# EAGLE design 3channel_thermocouple (EAGLE 7.7.0)
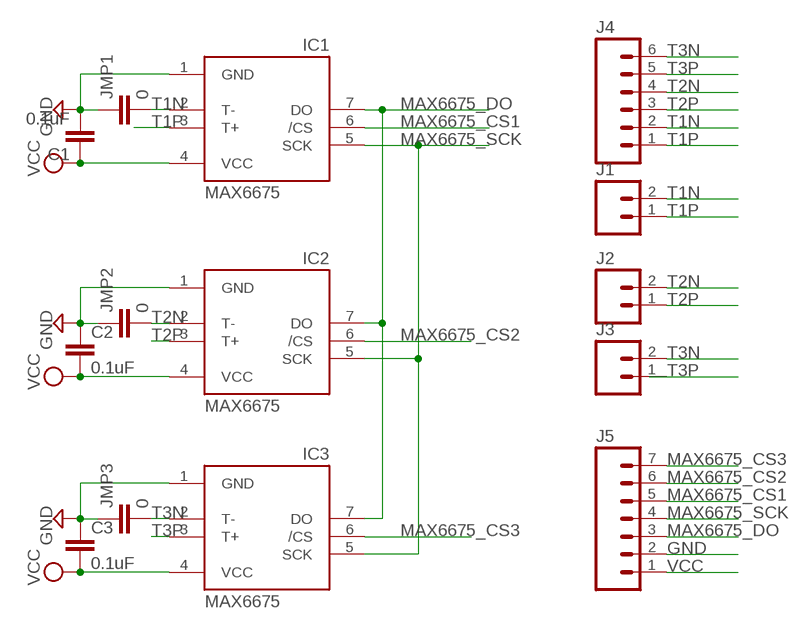
[diagram p0: schematic, sheet 1]

## Parts
C1  0.1uF  0.1UF-25V(+80/-20%)(0603)  [0603-CAP]
C2  0.1uF  0.1UF-25V(+80/-20%)(0603)  [0603-CAP]
C3  0.1uF  0.1UF-25V(+80/-20%)(0603)  [0603-CAP]
IC1  MAX6675  [SO08]
IC2  MAX6675  [SO08]
IC3  MAX6675  [SO08]
J1  M025MM  [SCREWTERMINAL-5MM-2]
J2  M025MM  [SCREWTERMINAL-5MM-2]
J3  M025MM  [SCREWTERMINAL-5MM-2]
J4  M06  [1X6-XH-JST-S6B-RIGHTANGLE]
J5  M07  [1X07]
JMP1  0  0.1UF-25V(+80/-20%)(0603)  [0603-CAP]
JMP2  0  0.1UF-25V(+80/-20%)(0603)  [0603-CAP]
JMP3  0  0.1UF-25V(+80/-20%)(0603)  [0603-CAP]

## Nets
GND: C1.2 C2.1 C3.1 IC1.1(GND) IC2.1(GND) IC3.1(GND) J5.2 JMP1.1 JMP2.1 JMP3.1
MAX6675_CS1: IC1.6(/CS) J5.5
MAX6675_CS2: IC2.6(/CS) J5.6
MAX6675_CS3: IC3.6(/CS) J5.7
MAX6675_DO: IC1.7(DO) IC2.7(DO) IC3.7(DO) J5.3
MAX6675_SCK: IC1.5(SCK) IC2.5(SCK) IC3.5(SCK) J5.4
T1N: IC1.2(T-) J1.2 J4.2 JMP1.2
T1P: IC1.3(T+) J1.1 J4.1
T2N: IC2.2(T-) J2.2 J4.4 JMP2.2
T2P: IC2.3(T+) J2.1 J4.3
T3N: IC3.2(T-) J3.2 J4.6 JMP3.2
T3P: IC3.3(T+) J3.1 J4.5
VCC: C1.1 C2.2 C3.2 IC1.4(VCC) IC2.4(VCC) IC3.4(VCC) J5.1

## Library data of the parts
C1-C3 = 3channel_thermocouple:0.1UF-25V(+80/-20%)(0603): CAP-00810 Ceramic Standard decoupling cap; PROD_ID: CAP-00810
IC1-IC3 = 3channel_thermocouple:MAX6675
J1-J3 = 3channel_thermocouple:M02: Standard 2-pin 0.1" header. Use with - straight break away headers ( PRT-00116) - right angle break away headers (PRT-00553) - swiss pins (PRT-00743) - machine pins (PRT-00117) - female headers (PRT-00115) Molex polarized connector foot print use with: PRT-08233 with associated crimp pins and housings. 2.54_SCREWTERM for use with PRT-10571. 3.5mm Screw Terminal footprints for PRT-08084 5mm Screw Terminal footprints for use with PRT-08432; STOREFRONT_ID: PRT-08432
J4 = 3channel_thermocouple:M06: Header 6 Standard 6-pin 0.1" header. Use with straight break away headers (SKU : PRT-00116), right angle break away headers (PRT-00553), swiss pins (PRT-00743), machine pins (PRT-00117), and female headers (PRT-00115). Molex polarized connector foot print use with SKU : PRT-08094 with associated crimp pins and housings. NOTES ON THE VARIANTS LOCK and LOCK_LONGPADS... This footprint was designed to help hold the alignment of a through-hole component (i.e. 6-pin header) while soldering it into place. You may notice that each hole has been shifted either up or down by 0.005 of an inch from it's more standard position (which is a perfectly straight line). This slight alteration caused the pins (the squares in the middle) to touch the edges of the holes. Because they are alternating, it causes a "brace" to hold the component in place. 0.005 has proven to be the perfect amount of "off-center" position when using our standard breakaway headers. Although looks a little odd when you look at the bare footprint, once you have a header in there, the alteration is very hard to notice. Also,if you push a header all the way into place, it is covered up entirely on the bottom side. This idea of altering the position of holes to aid alignment will be further integrated into the Sparkfun Library for other footprints. It can help hold any component with 3 or more connection pins.
J5 = 3channel_thermocouple:M07: Header 7 Standard 7-pin 0.1" header. Use with straight break away headers (SKU : PRT-00116), right angle break away headers (PRT-00553), swiss pins (PRT-00743), machine pins (PRT-00117), and female headers (PRT-00115). NOTES ON THE VARIANTS LOCK and LOCK_LONGPADS... This footprint was designed to help hold the alignment of a through-hole component (i.e. 7-pin header) while soldering it into place. You may notice that each hole has been shifted either up or down by 0.005 of an inch from it's more standard position (which is usually a perfectly straight line). This slight alteration caused the pins (the squares in the middle) to touch the edges of the holes. Because they are alternating, it causes a "brace" to hold the header in place. 0.005 has proven to be the perfect amount of "off-center" position when using our standard breakaway headers. Although looks a little odd when you look at the bare footprint, once you have a header in there, the alteration is very hard to notice. Also, if you push a header all the way into place, it is covered up entirely on the bottom side. This idea of altering the position of holes to aid alignment will be further integrated into the Sparkfun Library for other footprints. It can help hold any component with 3 or more connection pins.
JMP1-JMP3 = 3channel_thermocouple:0.1UF-25V(+80/-20%)(0603): CAP-00810 Ceramic Standard decoupling cap; PROD_ID: CAP-00810; VALUE: 0.1uF

## Board
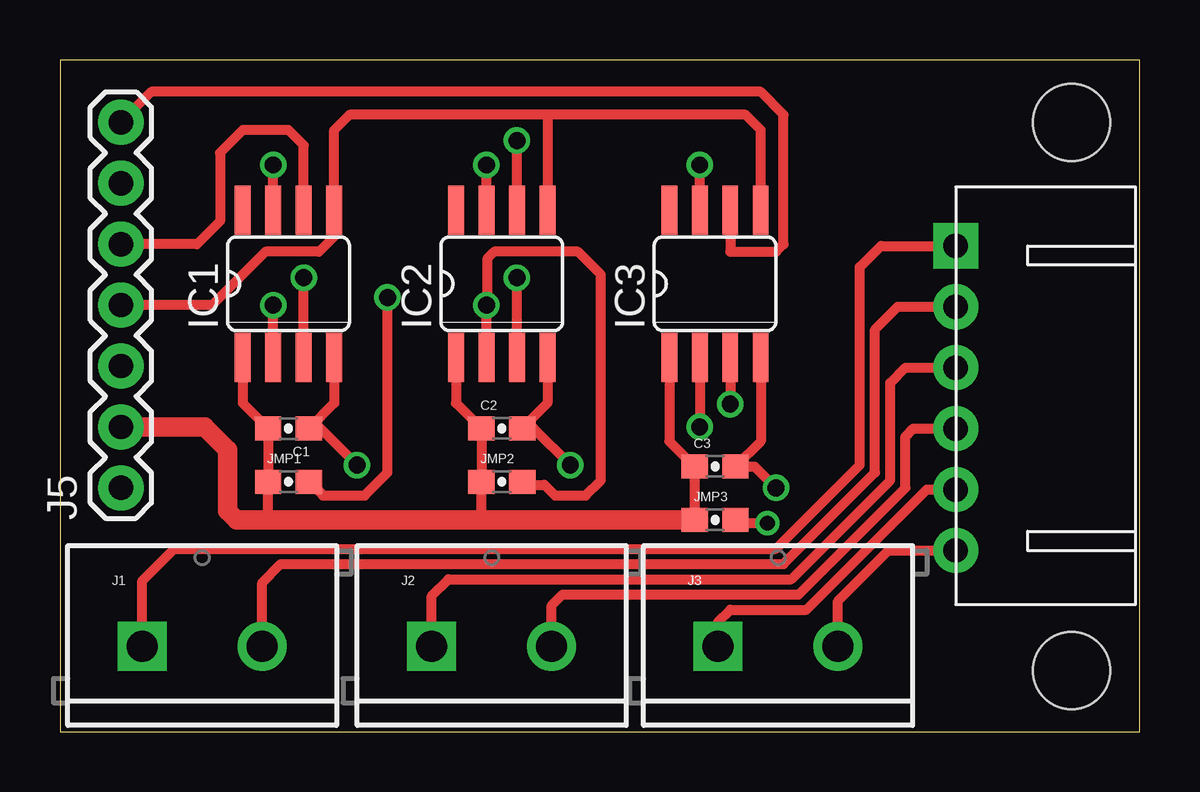
[diagram p1: board, top side]
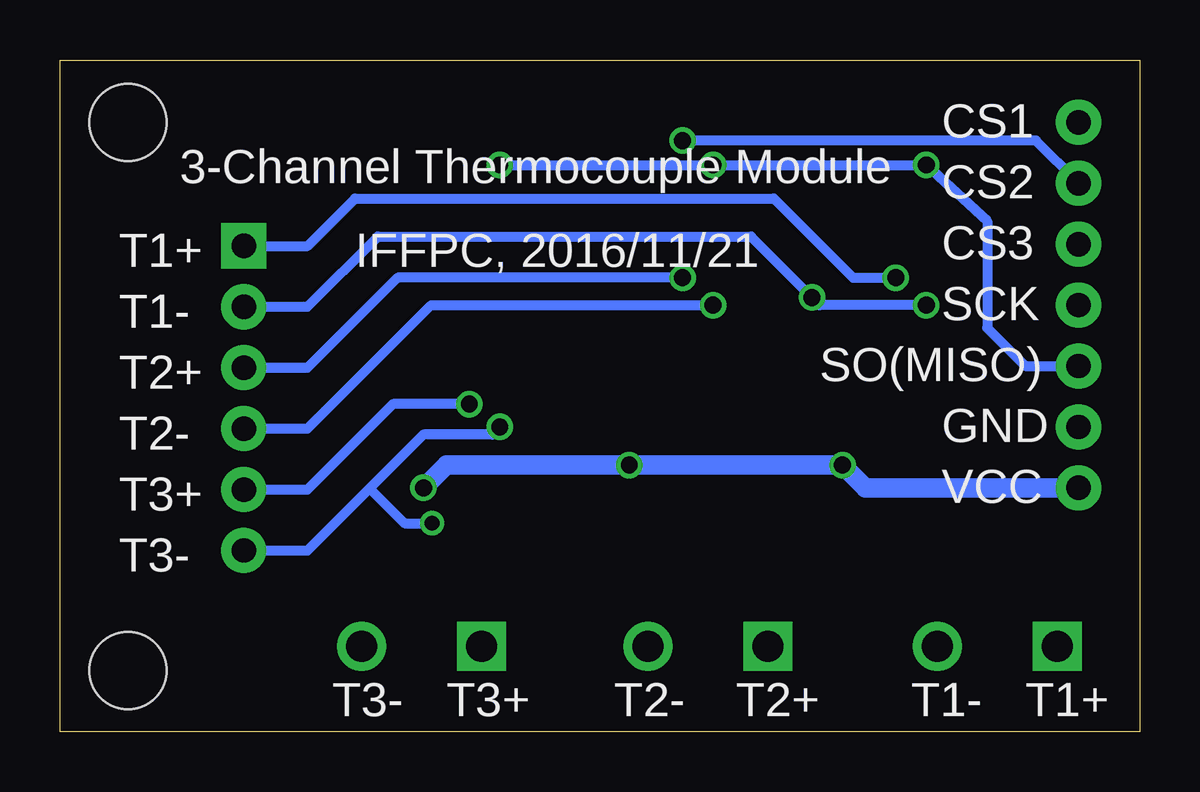
[diagram p2: board, bottom side, seen from below]

Size 45 x 28 mm. Coordinates in mm from the lower left corner, seen from the top.
Outline: 0,0 45,0 45,28 0,28 0,0
Copper layers (1*16): Top 0.035mm / dielectric 1.5mm / Bottom 0.035mm
Design rules "default": minimum track width 10mil, minimum drill 24mil, track to track 8mil, track to pad 8mil, pad to pad 8mil, via to via 8mil, smd to smd 8mil, copper to edge 40mil, drill to drill 8mil, minimum pad ring 10mil, minimum via ring 8mil, stop-mask expansion 4mil, vias tented up to drill 0mil, thermal gap 10mil
Holes 3.2 mm at 42.16,2.54 42.16,25.4

### Footprints (pad centres in the part's own frame; a part is rotated, then mirrored left to right if it is on the bottom)
0603-CAP = smd 1.1 x 1: 1 -0.85,0; 2 0.85,0
SO08 = smd 0.66 x 2.032: 1 -1.905,-3.073; 2 -0.635,-3.073; 3 0.635,-3.073; 4 1.905,-3.073; 5 1.905,3.073; 6 0.635,3.073; 7 -0.635,3.073; 8 -1.905,3.073
SCREWTERMINAL-5MM-2 = drill 1.3 pad 2.032 square: 1 0,0 | drill 1.3 pad 2.032: 2 5,0
1X6-XH-JST-S6B-RIGHTANGLE = drill 1.016 pad 1.88 square: 1 0,0 | drill 1.016 pad 1.88: 2 2.54,0; 3 5.08,0; 4 7.62,0; 5 10.16,0; 6 12.7,0
1X07 = drill 1.016 pad 1.88: 1 0,0; 2 2.54,0; 3 5.08,0; 4 7.62,0; 5 10.16,0; 6 12.7,0; 7 15.24,0

### Placement (x,y rotation side)
C1  9.53,12.64 180 top
C2  18.41,12.64 0 top
C3  27.3,11.05 0 top
IC1  9.53,18.67 0 top
IC2  18.41,18.67 0 top
IC3  27.3,18.67 0 top
J1  3.43,3.56 0 top
J2  15.49,3.56 0 top
J3  27.43,3.56 0 top
J4  37.34,20.25 270 top
J5  2.54,10.16 90 top
JMP1  9.53,10.41 0 top
JMP2  18.41,10.41 0 top
JMP3  27.3,8.83 0 top

### Tracks (layer width: path | path; a pad name or v marks a point on that pad's centre or on a via)
GND
  Top 0.406: IC1.1 7.62,13.69 C1.2 JMP1.1 8.68,8.93 8.57,8.83 | IC2.1 16.51,13.69 C2.1 | C2.1 JMP2.1 17.57,8.93 17.46,8.83 | IC3.1 25.4,12.1 C3.1 JMP3.1 | C2.1 17.46,12.53
  Top 0.813: JMP3.1 17.46,8.83 8.57,8.83 7.37,8.83 6.99,9.21 6.99,11.75 6.03,12.7 J5.2
MAX6675_CS1
  Top 0.406: IC1.6 10.16,24.45 9.53,25.08 7.62,25.08 6.67,24.13 6.67,21.27 5.71,20.32 J5.5
MAX6675_CS2  (via drill 0.7)
  Top 0.406: IC2.6 v19.05,24.64
  Bottom 0.406: J5.6 4.32,24.64 v19.05,24.64
MAX6675_CS3
  Top 0.406: IC3.6 27.94,20 29.84,20 30.16,20.32 30.16,25.72 29.21,26.67 3.81,26.67 J5.7
MAX6675_DO  (via drill 0.7)
  Top 0.406: IC1.7 v8.89,23.62 | IC2.7 v17.78,23.62 | IC3.7 v26.67,23.62
  Bottom 0.406: v26.67,23.62 v17.78,23.62 v8.89,23.62 6.35,21.27 6.35,16.83 4.76,15.24 J5.3
MAX6675_SCK
  Top 0.406: 20.32,25.72 IC2.5 | IC3.5 29.21,25.08 28.57,25.72 20.32,25.72 | 20.32,25.72 12.06,25.72 11.43,25.08 IC1.5 11.43,20.64 10.79,20 8.57,20 6.35,17.78 J5.4
T1N  (via drill 0.7)
  Top 0.254: 10.52,10.29 JMP1.2
  Top 0.406: IC1.2 v8.89,17.78 | J1.2 8.43,6.21 9.21,6.99 30.16,6.99 33.97,10.79 33.97,16.76 34.92,17.71 J4.2 | 10.52,10.29 10.96,9.84 12.7,9.84 13.65,10.79 v13.65,18.1
  Bottom 0.406: J4.2 34.68,17.71 31.75,20.64 16.19,20.64 v13.65,18.1 13.34,17.78 v8.89,17.78
T1P  (via drill 0.7)
  Top 0.406: IC1.3 v10.16,18.92 | J1.1 3.43,6.29 4.76,7.62 29.84,7.62 33.34,11.11 33.34,19.37 34.22,20.25 J4.1
  Bottom 0.406: J4.1 34.68,20.25 32.7,22.23 15.24,22.23 11.94,18.92 v10.16,18.92
T2N  (via drill 0.7)
  Top 0.254: 19.43,10.29 JMP2.2 | 17.83,17.83 v17.78,17.78
  Top 0.406: IC2.2 v17.78,17.78 | J2.2 20.49,5.25 20.95,5.71 30.8,5.71 35.24,10.16 35.24,12.31 35.56,12.63 J4.4 | 19.43,10.29 20.19,10.29 20.64,9.84 21.91,9.84 22.54,10.48 22.54,19.05 21.59,20 18.1,20 17.83,19.74 17.83,17.83
  Bottom 0.406: J4.4 34.68,12.63 29.53,17.78 v17.78,17.78
T2P  (via drill 0.7)
  Top 0.406: IC2.3 v19.05,18.92 | J2.1 15.49,5.65 16.19,6.35 30.48,6.35 34.61,10.48 34.61,14.54 35.24,15.17 J4.3
  Bottom 0.406: J4.3 34.68,15.17 30.92,18.92 v19.05,18.92
T3N  (via drill 0.61, 0.7)
  Top 0.254: 28.35,8.69 JMP3.2
  Top 0.406: IC3.2 v26.67,12.7 | J3.2 32.43,5.44 34.54,7.55 J4.6 | v29.49,8.69 28.35,8.69
  Bottom 0.406: 32.09,10.14 34.68,7.55 J4.6 | 32.09,10.14 29.84,12.38 26.99,12.38 v26.67,12.7 | v29.49,8.69 30.63,8.69 32.09,10.14
T3P  (via drill 0.7)
  Top 0.406: IC3.3 v27.94,13.65 | J4.5 36.12,10.09 31.11,5.08 27.94,5.08 27.43,4.57 J3.1
  Bottom 0.406: J4.5 34.68,10.09 31.11,13.65 v27.94,13.65
VCC  (via drill 0.7)
  Top 0.406: IC1.4 11.43,13.69 C1.1 10.86,12.64 v12.38,11.11 | IC2.4 20.32,13.69 C2.2 19.75,12.64 v21.27,11.11 | IC3.4 29.21,12.1 C3.2 28.96,11.05 v29.84,10.16
  Bottom 0.813: v29.84,10.16 28.89,11.11 v21.27,11.11 v12.38,11.11 11.43,10.16 J5.1

### Text on the board
bPlace: CS1 | 3-Channel Thermocouple Module | CS2 | CS3 | IFFPC, 2016/11/21 | T1+ | SCK | T1- | SO(MISO) | T2+ | GND | T2- | VCC | T3+ | T3- | T1+ | T1- | T2+ | T2- | T3+ | T3-